# EAGLE design Adafruit MCP23017 GPIO Expander (EAGLE 9.6.2)
COMPANY: ADAFRUIT INDUSTRIES; DRAWN: KTOWN; REV: A
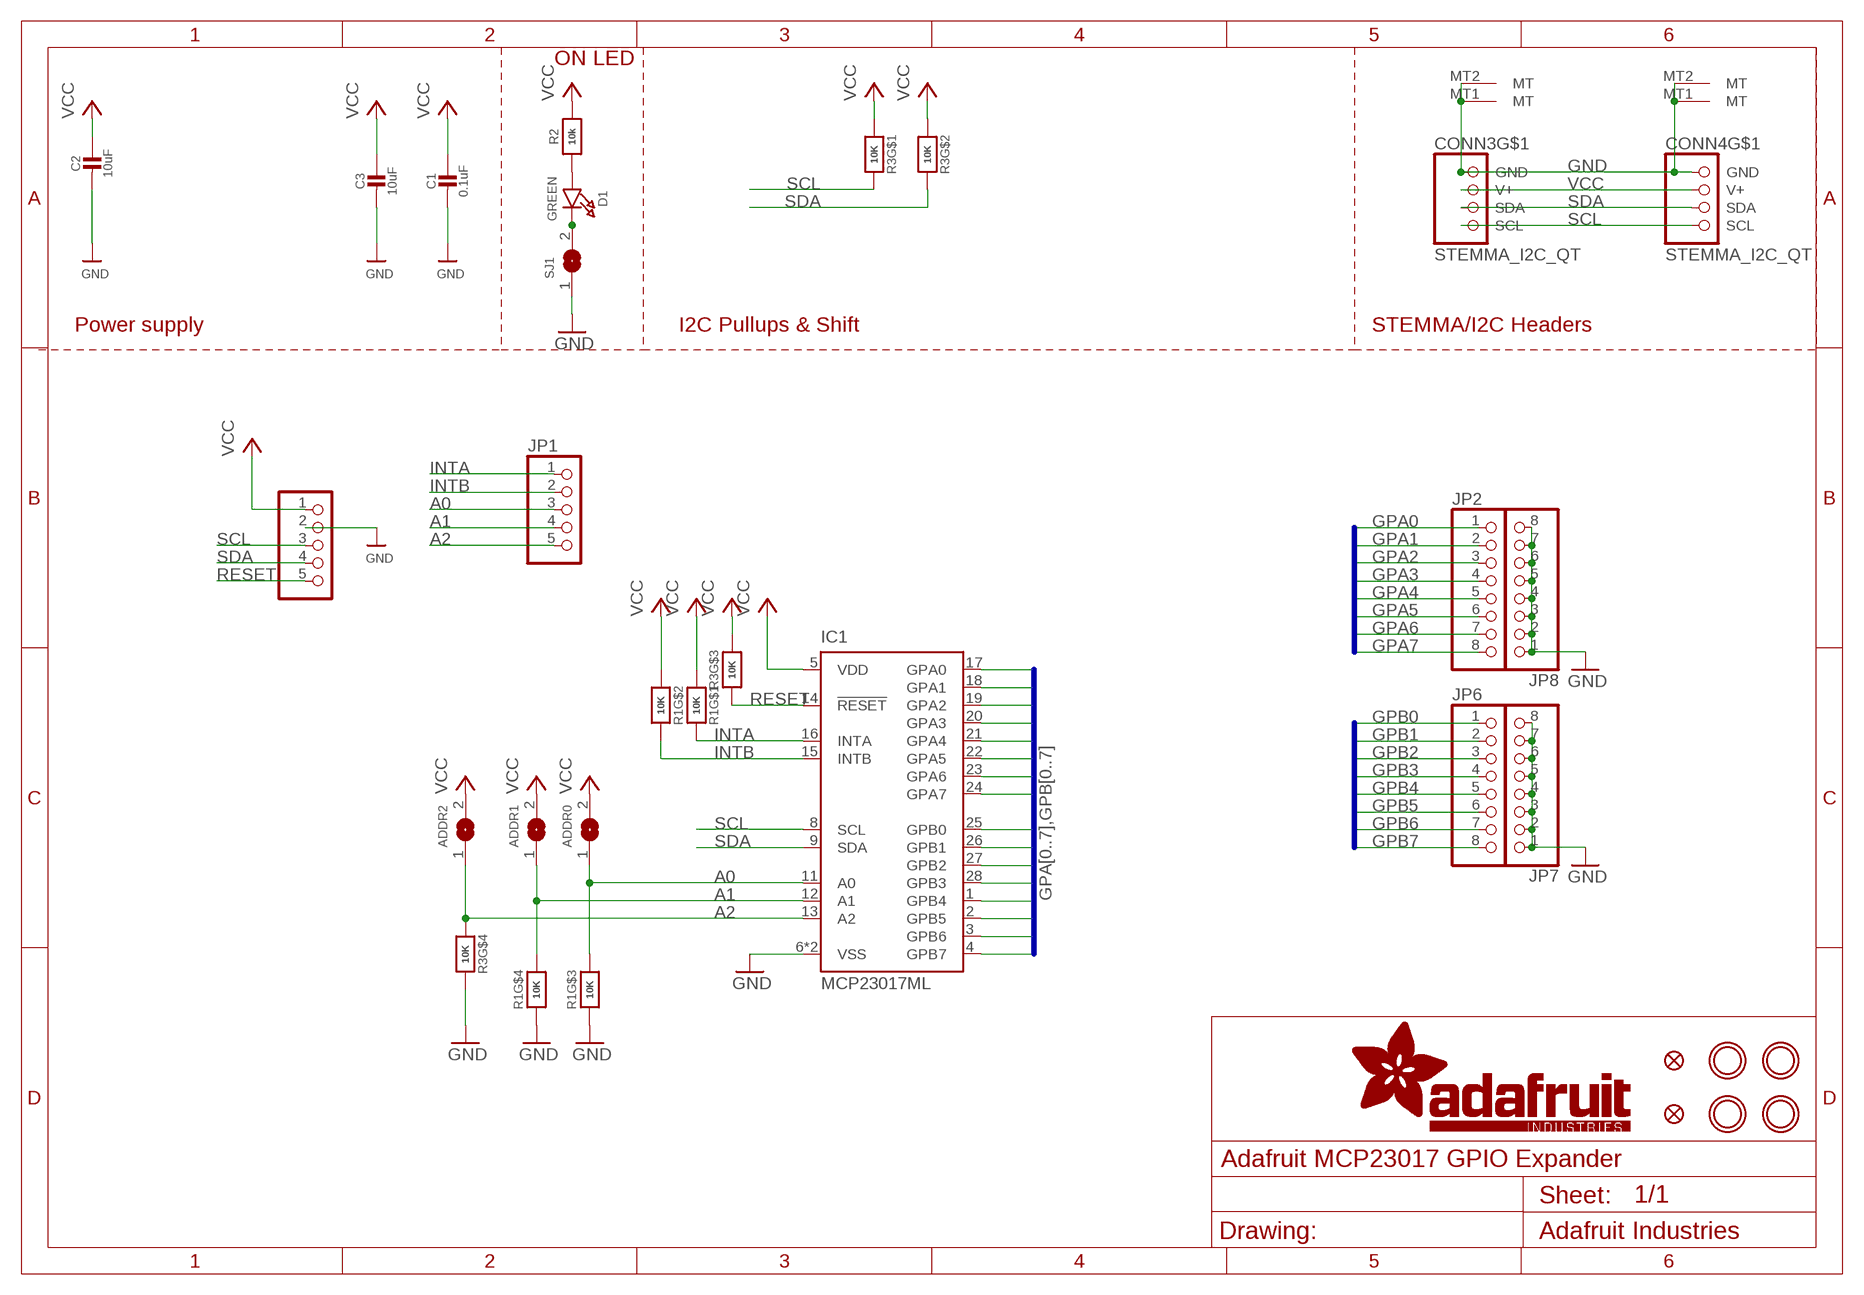
[diagram p0: schematic, sheet 1]

## Parts
ADDR0  SOLDERJUMPER  [SOLDERJUMPER_ARROW_NOPASTE]
ADDR1  SOLDERJUMPER  [SOLDERJUMPER_ARROW_NOPASTE]
ADDR2  SOLDERJUMPER  [SOLDERJUMPER_ARROW_NOPASTE]
C1  0.1uF  CAP_CERAMIC0603_NO  [0603-NO]
C2  10uF  CAP_CERAMIC0805-NOOUTLINE  [0805-NO]
C3  10uF  CAP_CERAMIC0805-NOOUTLINE  [0805-NO]
CONN3  STEMMA_I2C_QT  [JST_SH4]
CONN4  STEMMA_I2C_QT  [JST_SH4]
D1  GREEN  LED0603_NOOUTLINE  [CHIPLED_0603_NOOUTLINE]
FID3  FIDUCIAL_1MM  [FIDUCIAL_1MM]
FID4  FIDUCIAL_1MM  [FIDUCIAL_1MM]
IC1  MCP23017ML  [QFN28-ML_6X6MM]
JP1  HEADER-1X570MIL  [1X05_ROUND_70]
JP2  HEADER-1X870MIL  [1X08_ROUND_70]
JP5  HEADER-1X570MIL  [1X05_ROUND_70]
JP6  HEADER-1X870MIL  [1X08_ROUND_70]
JP7  HEADER-1X870MIL  [1X08_ROUND_70]
JP8  HEADER-1X870MIL  [1X08_ROUND_70]
R1  10K  RESISTOR_4PACK  [RESPACK_4X0603]
R2  10k  RESISTOR_0603_NOOUT  [0603-NO]
R3  10K  RESISTOR_4PACK  [RESPACK_4X0603]
SJ1  SOLDERJUMPERCLOSED  [SOLDERJUMPER_CLOSEDWIRE]
U$1  MOUNTINGHOLE2.5  [MOUNTINGHOLE_2.5_PLATED]
U$17  MOUNTINGHOLE2.5  [MOUNTINGHOLE_2.5_PLATED]
U$19  MOUNTINGHOLE2.5  [MOUNTINGHOLE_2.5_PLATED]
U$21  MOUNTINGHOLE2.5  [MOUNTINGHOLE_2.5_PLATED]

## Nets
A0: ADDR0.1 IC1.11(A0) JP1.3 R1.6
A1: ADDR1.1 IC1.12(A1) JP1.4 R1.5
A2: ADDR2.1 IC1.13(A2) JP1.5 R3.4
GND [highpower]: C1.2 C2.2 C3.2 CONN3.1(GND) CONN3.MT1(MT) CONN3.MT2(MT) CONN4.1(GND) CONN4.MT1(MT) CONN4.MT2(MT) IC1.6(VSS) IC1.EXP(VSS) JP5.2 JP7.1 JP7.2 JP7.3 JP7.4 JP7.5 JP7.6 JP7.7 JP7.8 JP8.1 JP8.2 JP8.3 JP8.4 JP8.5 JP8.6 JP8.7 JP8.8 R1.3 R1.4 R3.5 SJ1.1
GPA0: IC1.17(GPA0) JP2.1
GPA1: IC1.18(GPA1) JP2.2
GPA2: IC1.19(GPA2) JP2.3
GPA3: IC1.20(GPA3) JP2.4
GPA4: IC1.21(GPA4) JP2.5
GPA5: IC1.22(GPA5) JP2.6
GPA6: IC1.23(GPA6) JP2.7
GPA7: IC1.24(GPA7) JP2.8
GPB0: IC1.25(GPB0) JP6.1
GPB1: IC1.26(GPB1) JP6.2
GPB2: IC1.27(GPB2) JP6.3
GPB3: IC1.28(GPB3) JP6.4
GPB4: IC1.1(GPB4) JP6.5
GPB5: IC1.2(GPB5) JP6.6
GPB6: IC1.3(GPB6) JP6.7
GPB7: IC1.4(GPB7) JP6.8
INTA: IC1.16(INTA) JP1.1 R1.8
INTB: IC1.15(INTB) JP1.2 R1.7
N$1: D1.A R2.1
N$2 [highpower]: D1.C SJ1.2
RESET: IC1.14(!RESET) JP5.5 R3.3
SCL: CONN3.4(SCL) CONN4.4(SCL) IC1.8(SCL) JP5.3 R3.8
SDA: CONN3.3(SDA) CONN4.3(SDA) IC1.9(SDA) JP5.4 R3.7
VCC [highpower]: ADDR0.2 ADDR1.2 ADDR2.2 C1.1 C2.1 C3.1 CONN3.2(V+) CONN4.2(V+) IC1.5(VDD) JP5.1 R1.1 R1.2 R2.2 R3.1 R3.2 R3.6

## Buses
GPA[0..7],GPB[0..7]

## Notes on the sheet
- ON LED
- Power supply | I2C Pullups & Shift | STEMMA/I2C Headers

## Library data of the parts
ADDR0 ADDR1 ADDR2 = microbuilder:SOLDERJUMPER: SMD Solder JUMPER Solder the two pads together to create a connection, or remove the solder to break it. REFLOW - Use this footprint for solder paste and reflow ovens. WAVE - Use this footprint for hand-soldering (larger pads). CLOSED - Has a trace between the two pads to ensure it is closed by default. The trace needs to be cut to disable the jumper, and can be closed again by creating a solder bridge between the two pads.; BOM: EXCLUDE
C1-C3 = microbuilder:CAP_CERAMIC: Ceramic Capacitors For new designs, use the packages preceded by an '_' character since they are more reliable: The following footprints should be used on most boards: _0402 - Standard footprint for regular board layouts _0603 - Standard footprint for regular board layouts _0805 - Standard footprint for regular board layouts _1206 - Standard footprint for regular board layouts For extremely tight-pitch boards where space is at a premium, the following 'micro-pitch' footprints can be used (smaller pads, no silkscreen outline, etc.): _0402MP - Micro-pitch footprint for very dense/compact boards _0603MP - Micro-pitch footprint for very dense/compact boards _0805MP - Micro-pitch footprint for very dense/compact boards _1206MP - Micro-pitch footprint for very dense/compact boards
CONN3 CONN4 = microbuilder:STEMMA_I2C
D1 = microbuilder:LED: LED 0603 - 0603 Surface Mount Package 2mA: Green LED - Low Power (3.9mcd, 2ma, 1.7Vf) - Digikey: 475-2709-2-ND Orange LED - Low Power (9.8mcd, 2ma, 1.8Vf) - Digikey: 475-1194-2-ND Red LED - Low Power (5mcd, 2ma, 1.8Vf) - Digikey: 475-1195-2-ND Yellow LED - Low Power (7mcd, 2ma, 1.8Vf) - Digikey: 475-1196-2-ND 5mA: Blue LED - Low Power (17mcd, 5ma, 2.9Vf) - Digikey: LNJ937W8CRACT-ND 0805 - 0805 Surface Mount Package 2mA: Red LED (8.8mcd, 2mA, 1.8Vf, Clear) - Low Power [Digikey: 475-2510-1-ND] Green LED (5mcd, 2mA, 1.8Vf, Clear) - Low Power [Digikey: 475-2730-1-ND] Yellow LED (11.3mcd, 2mA, 1.8Vf, Clear) - Low Power [Digikey: 475-2555-1-ND] 20mA: Red LED (104mcd, 20mA, Diffused) - LS R976 [Digikey: 475-1278-6-ND] Red LED (12mcd, 20mA, 2.0Vf, Clear) - APT2012EC [Digikey: 754-1128-1-ND] Green LED (15mcd, 20mA, 2.2Vf, Clear) - APT2012GC [Digikey: 754-1131-1-ND] Orange LED (160mcd, 20mA, 2.1Vf, Clear) - APT2012SECK [Digikey: 754-1130-1-ND] 1206 - 1206 Surface Mount Package Green LED (26mcd, 20mA, Diffused) - LG N971 [Digikey: 475-1407-6-ND] Red LED (15mcd, 20mA, Diffused) - LH N974 [Digikey: 475-1416-6-ND] Cree - Cree High-Power Surface Mount LEDs XPEBWT-L1-0000-00D50 - White 111lm 350mA 2.9Vf 6200K 110° XTEAWT-00-0000-00000LEE3 - White 114lm 350mA 2.85Vf 5000K 115° Everlight - Everlight 45-21 Series Surface Mount LEDs 45-21/QK2C-B2832AC2CB2/2T - Warm White 2000mcd 20mA 3.25Vf 3050K 120° 45-21/LK2C-B38452C4CB2/2T - Nuetral White 2000mcd 20mA 3.25Vf 4150K 120° 45-21/LK2C-B50634C6CB2/2T - Cold White 2200mcd 20mA 3.25Vf 5650K 120° PLCC2 Reverse Mount LS T77K-J1L2-1-0-2-R18-Z - Red 11.25mcd 2mA 1.8Vf 630nm 120° LO T77K-L1M2-24-Z - Orange 19.6mcd 2mA 1.8Vf 606nm 120° LY T77K-K2M1-26-Z - Yellow 15.7mcd 2mA 1.8Vf 587nm 120°
FID3 FID4 = microbuilder:FIDUCIAL: Fiducial Alignment Points Various fiducial points for machine vision alignment.; BOM: EXCLUDE
IC1 = microbuilder:MCP23017: http://ww1.microchip.com/downloads/en/DeviceDoc/21952a.pdf Source: http://ww1.microchip.com/downloads/en/DeviceDoc/21952a.pdf; MF: MICROCHIP; MPN: MCP23017-E/ML; OC_FARNELL: unknown; OC_NEWARK: 31K2957
JP1 JP5 = microbuilder:HEADER-1X5: PIN HEADER
JP2 JP6-JP8 = microbuilder:HEADER-1X8: PIN HEADER
R1 R3 = microbuilder:RESISTOR_4PACK: Resistor Packs (4 resistors) 4 x 0603 10K 1/16W - Digikey: YC164J-10KCT-ND
R2 = microbuilder:RESISTOR: Resistors For new designs, use the packages preceded by an '_' character since they are more reliable: The following footprints should be used on most boards: _0402 - Standard footprint for regular board layouts _0603 - Standard footprint for regular board layouts _0805 - Standard footprint for regular board layouts _1206 - Standard footprint for regular board layouts For extremely tight-pitch boards where space is at a premium, the following 'micro-pitch' footprints can be used (smaller pads, no silkscreen outline, etc.): _0402MP - Micro-pitch footprint for very dense/compact boards _0603MP - Micro-pitch footprint for very dense/compact boards _0805MP - Micro-pitch footprint for very dense/compact boards _1206MP - Micro-pitch footprint for very dense/compact boards
SJ1 = microbuilder:SOLDERJUMPER: SMD Solder JUMPER Solder the two pads together to create a connection, or remove the solder to break it. REFLOW - Use this footprint for solder paste and reflow ovens. WAVE - Use this footprint for hand-soldering (larger pads). CLOSED - Has a trace between the two pads to ensure it is closed by default. The trace needs to be cut to disable the jumper, and can be closed again by creating a solder bridge between the two pads.
U$1 U$17 U$19 U$21 = adafruit_electromech:MOUNTINGHOLE: Mounting Hole For #2 screws (0.086"/2.18mm width, 0.094"/2.4mm hole) use 2.5mm; BOM: EXCLUDE

## Net classes
1 highpower: width 0.305 mm, drill 0.483 mm
2 lowpower: width 0.254 mm, drill 0.483 mm

## Board
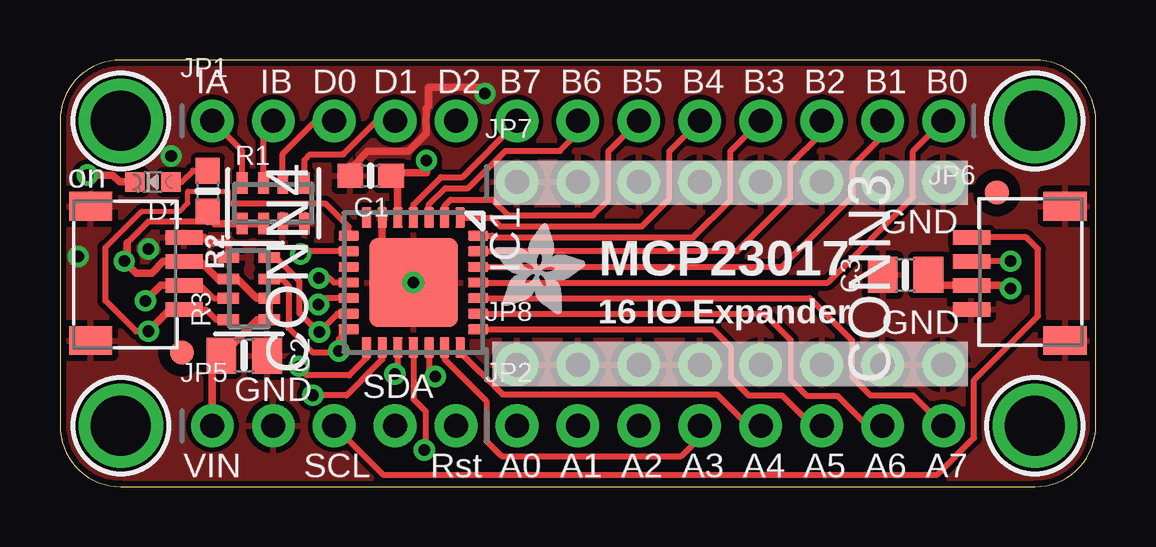
[diagram p1: board, top side]
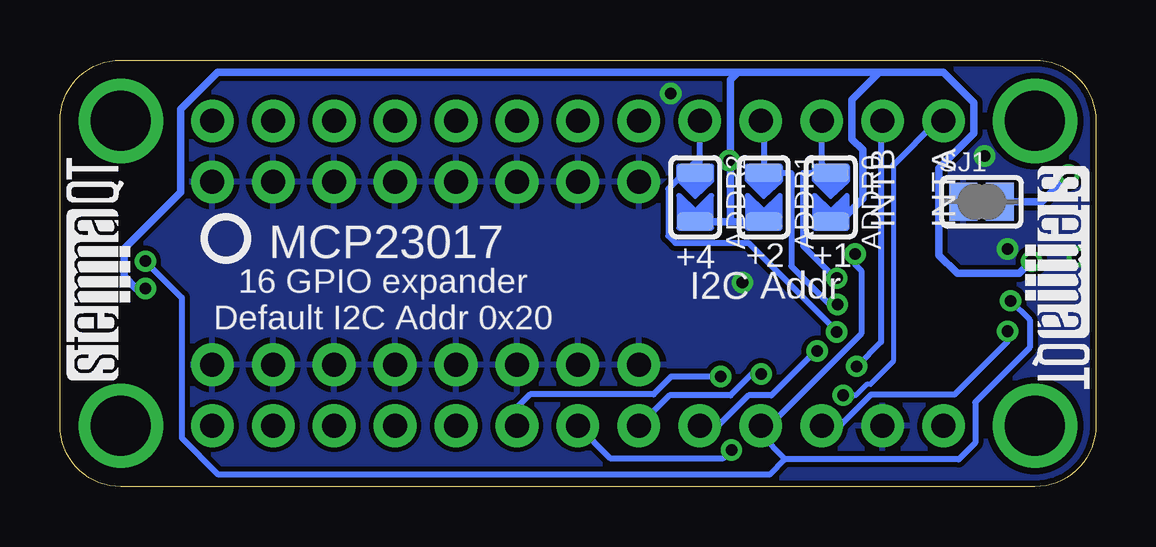
[diagram p2: board, bottom side, seen from below]

Size 43.18 x 17.78 mm. Coordinates in mm from the lower left corner, seen from the top.
Outline: 0,15.24 0,2.54 arc90 2.54,0 40.64,0 arc90 43.18,2.54 43.18,15.24 arc90 40.64,17.78 2.54,17.78 arc90 0,15.24
Copper layers (1*16): Top 0.035mm / dielectric 1.5mm / Bottom 0.035mm
Design rules "adafruit *": minimum track width 8mil, minimum drill 15.5mil, track to track 8mil, track to pad 8mil, pad to pad 8mil, via to via 8mil, smd to smd 8mil, copper to edge 10mil, drill to drill 8mil, minimum pad ring 10mil, minimum via ring 8mil, stop-mask expansion 2mil, vias tented up to drill 20mil, thermal gap 10mil

### Footprints (pad centres in the part's own frame; a part is rotated, then mirrored left to right if it is on the bottom)
SOLDERJUMPER_ARROW_NOPASTE = smd 0.762 x 1.524: 1 -1.016,0; 2 1.016,0
0603-NO = smd 1.075 x 1: 1 -0.85,0; 2 0.85,0
0805-NO = smd 1.24 x 1.5: 1 -0.95,0; 2 0.95,0
JST_SH4 = smd 0.6 x 1.55: 1 -1.5,2.514; 2 -0.5,2.514; 3 0.5,2.514; 4 1.5,2.514 | smd 1.2 x 1.8: MT1 -2.8,-1.386; MT2 2.8,-1.386
CHIPLED_0603_NOOUTLINE = smd 0.8 x 0.8: A 0,-0.75; C 0,0.75
FIDUCIAL_1MM = smd 1 x 1: 1 0,0
QFN28-ML_6X6MM = smd 0.85 x 0.4: 1 -2.7,1.95; 2 -2.7,1.3; 3 -2.7,0.65; 4 -2.7,0; 5 -2.7,-0.65; 6 -2.7,-1.3; 7 -2.7,-1.95; 15 2.7,-1.95; 16 2.7,-1.3; 17 2.7,-0.65; 18 2.7,0; 19 2.7,0.65; 20 2.7,1.3; 21 2.7,1.95 | smd 0.4 x 0.85: 8 -1.95,-2.7; 9 -1.3,-2.7; 10 -0.65,-2.7; 11 0,-2.7; 12 0.65,-2.7; 13 1.3,-2.7; 14 1.95,-2.7; 22 1.95,2.7; 23 1.3,2.7; 24 0.65,2.7; 25 0,2.7; 26 -0.65,2.7; 27 -1.3,2.7; 28 -1.95,2.7 | smd 3.7 x 3.7: EXP 0,0
1X05_ROUND_70 = drill 1 pad 1.778: 1 -5.08,0; 2 -2.54,0; 3 0,0; 4 2.54,0; 5 5.08,0
1X08_ROUND_70 = drill 1 pad 1.778: 1 -8.89,0; 2 -6.35,0; 3 -3.81,0; 4 -1.27,0; 5 1.27,0; 6 3.81,0; 7 6.35,0; 8 8.89,0
RESPACK_4X0603 = smd 0.45 x 0.9: 1 -1.3,-0.85; 2 -0.4,-0.85; 3 0.4,-0.85; 4 1.3,-0.85; 5 1.3,0.85; 6 0.4,0.85; 7 -0.4,0.85; 8 -1.3,0.85
SOLDERJUMPER_CLOSEDWIRE = smd 1.168 x 1.6: 1 -0.762,0; 2 0.762,0 | smd 0.635 x 0.203: WIRE 0,0
MOUNTINGHOLE_2.5_PLATED = drill 2.5 pad 3.2: P$1 0,0

### Placement (x,y rotation side)
ADDR0  11.05,12.06 270 bottom
ADDR1  13.84,12.06 270 bottom
ADDR2  16.7,12.06 270 bottom
C1  12.95,12.95 180 top
C2  7.68,5.46 0 top
C3  35.24,8.83 180 top
CONN3  40.51,8.89 90 top
CONN4  2.67,8.89 270 top
D1  3.87,12.7 90 top
FID3  5.08,5.59 0 top
FID4  39.05,12.26 0 top
IC1  14.73,8.51 270 top
JP1  11.43,15.24 0 top
JP2  27.94,2.54 0 top
JP5  11.43,2.54 0 top
JP6  27.94,15.24 180 top
JP7  27.94,12.7 0 top
JP8  27.94,5.08 0 top
R1  8.89,11.81 0 top
R2  6.16,12.32 270 top
R3  7.87,8.26 90 top
SJ1  4.76,11.87 0 bottom
U$1  2.54,15.24 0 top
U$17  40.64,15.24 0 top
U$19  2.54,2.54 0 top
U$21  40.64,2.54 0 top
U$22  [ADAFRUIT_3.5MM]  18.1,7.18 0 top
U$25  [PCBFEAT-REV-040]  36.26,10.35 0 bottom
U$30  [STEMMAQT]  40.26,4.45 90 bottom
U$31  [STEMMAQT]  2.92,13.34 270 bottom

### Tracks (layer width: path | path; a pad name or v marks a point on that pad's centre or on a via)
A0  (via drill 0.48)
  Top 0.254: R1.6 9.29,13.88 10.65,15.24 JP1.3 | IC1.11 11.42,8.51 11.24,8.69 v10.79,8.69
  Bottom 0.254: JP1.3 11.43,13.46 ADDR0.1 12.19,13.08 12.19,10.02 10.86,8.69 v10.79,8.69
A1  (via drill 0.48)
  Top 0.254: R1.5 10.19,13.62 10.41,13.84 11.81,13.84 13.21,15.24 JP1.4 | IC1.12 11.03,7.86 v10.77,7.6
  Bottom 0.254: JP1.4 13.84,15.11 ADDR1.1 12.7,13.08 12.7,9.19 11.11,7.6 v10.77,7.6
A2  (via drill 0.48)
  Top 0.254: IC1.13 11.57,7.21 v10.81,6.45 10.49,6.76 10.45,6.76 9.98,7.23 9.98,8.57 9,9.55 R3.4
  Bottom 0.254: ADDR2.1 16.7,13.53 16.76,13.46 | JP1.5 16.51,13.46 16.76,13.46 | 16.76,13.46 17.82,12.41 17.82,10.45 17.53,10.16 14.48,10.16 10.81,6.49 v10.81,6.45
GND  (via drill 0.48)
  Top 0.305: CONN4.1 5.99,10.39 6.23,10.15 6.99,10.15 7.02,10.12 R3.5 | IC1.6 13.43,9.81 IC1.EXP | 1.28,11.81 CONN4.MT1 | C1.2 12.1,13.36 12.29,13.36 12.29,13.44 12.83,13.97 14.53,13.97 15.27,14.71 15.27,15.76 15.37,15.86 15.37,16.64 17.46,16.64 v17.72,16.38
  other vias: 4.64,13.78 3.68,9.91 14.73,8.51 0.76,9.59
  pour Top: 0,17.78 43.18,17.78 43.18,0 0,0
  pour Bottom: 0,17.78 43.18,17.78 43.18,0 0,0
GPA0  (via drill 0.48)
  Top 0.254: IC1.17 14.08,4.82 v13.96,4.7
  Bottom 0.254: v13.96,4.7 14.34,4.7 15.23,3.81 17.78,3.81 JP2.1
GPA1  (via drill 0.48)
  Top 0.254: IC1.18 14.73,3.65 15.24,3.14 15.24,1.58 v15.19,1.52
  Bottom 0.254: v15.19,1.52 15.52,1.2 20.25,1.2 JP2.2
GPA2  (via drill 0.48)
  Top 0.254: IC1.19 15.38,4.86 v15.64,4.6
  Bottom 0.254: v15.64,4.6 17.69,4.6 18.44,3.85 23.58,3.85 24.13,3.3 JP2.3
GPA3
  Top 0.254: IC1.20 16.03,5.3 17.78,3.56 17.78,1.9 18.41,1.27 25.91,1.27 26.67,2.03 JP2.4
GPA4
  Top 0.254: IC1.21 16.68,5.61 18.44,3.85 27.39,3.85 28.7,2.54 JP2.5
GPA5
  Top 0.254: IC1.22 27.22,6.56 27.96,5.82 27.96,4.55 28.7,3.81 30.1,3.81 31.37,2.54 JP2.6
GPA6
  Top 0.254: JP2.7 33.66,2.54 32.41,3.79 31.14,3.79 30.45,4.47 30.45,6.12 29.37,7.21 IC1.23
GPA7
  Top 0.254: JP2.8 35.56,3.81 33.78,3.81 33.02,4.57 33.02,6.1 31.26,7.86 IC1.24
GPB0
  Top 0.254: IC1.25 32,8.51 35.56,12.06 35.56,13.97 JP6.1
GPB1
  Top 0.254: JP6.2 34.29,14.61 33.06,13.37 33.06,12.12 30.1,9.16 IC1.26
GPB2
  Top 0.254: IC1.27 18.19,9.81 18.19,9.8 28.22,9.8 30.45,12.04 30.45,13.44 31.75,14.73 JP6.3
GPB3
  Top 0.254: IC1.28 18.02,10.46 18.09,10.39 26.39,10.39 27.94,11.94 27.94,13.97 JP6.4
GPB4
  Top 0.254: IC1.1 17.98,11.21 18.35,10.85 24.26,10.85 25.4,11.99 25.4,13.97 JP6.5
GPB5
  Top 0.254: IC1.2 16.03,11.71 16.28,11.96 18.01,11.96 18.67,11.3 22.23,11.3 22.86,11.94 22.86,13.97 JP6.6
GPB6
  Top 0.254: IC1.3 15.38,11.76 16.07,12.45 17.02,12.45 18.57,13.99 20.85,13.99 21.59,14.73 JP6.7
GPB7
  Top 0.254: IC1.4 14.73,11.76 15.88,12.9 16.78,12.9 19.05,15.18 JP6.8
INTA  (via drill 0.48)
  Top 0.254: R1.8 7.59,14 JP1.1 | v10.54,3.81 11.94,3.81 13.43,5.3 IC1.16
  Bottom 0.203: 8.45,13.4 8.45,5.22 9.4,4.27 9.55,4.27 10.01,3.81 10.1,3.81
  Bottom 0.254: 10.1,3.81 v10.54,3.81 | 8.45,13.4 6.6,15.24 JP1.1
INTB  (via drill 0.48)
  Top 0.254: R1.7 8.49,14.84 JP1.2 | IC1.15 12.78,5.36 12.05,4.64 10.29,4.64 9.97,4.95 v9.97,5.02
  Bottom 0.254: v9.97,5.02 8.95,6.03 8.95,15.18 JP1.2
N$1
  Top 0.254: R2.1 5.55,13.17 5.08,12.7 D1.A
N$2  (via drill 0.48)
  Top 0.305: D1.C 2.49,12.7 2.2,12.99 v1.14,12.99
  Bottom 0.305: SJ1.2 2.25,11.87 v1.14,12.99
RESET  (via drill 0.48)
  Top 0.254: R3.3 9.25,8.65 9.53,8.38 9.53,6.6 10.54,5.59 11.56,5.59 v11.62,5.65 11.62,6.15 IC1.14
  Bottom 0.254: v11.62,5.65 11.68,5.65 13.53,3.81 14.48,3.81 15.75,2.54 JP5.5
SCL  (via drill 0.48)
  Top 0.203: 7.11,11.81 7.03,11.81 7.03,12.32 5.33,12.32 5.33,11.8 5,11.48 3.42,11.48 1.91,9.97
  Top 0.254: CONN4.4 6.08,7.39 6.52,6.96 R3.8 | JP5.3 13.46,0.51 36.58,0.51 38.1,2.03 38.1,4.45 40.77,7.11 40.77,9.91 40.28,10.39 CONN3.4 | IC1.8 12.03,10.83 11.05,11.81 7.11,11.81 | v3.68,6.48 3.17,6.48 1.91,7.75 1.91,9.97
  Top 0.305: CONN4.4 4.6,7.39 v3.68,6.48
  Bottom 0.254: JP5.3 10.67,2.54 9.37,3.83 5.9,3.83 3.68,6.05 v3.68,6.48
SDA  (via drill 0.48)
  Top 0.254: CONN4.3 5.85,8.39 6.39,7.86 R3.7 | v39.62,9.4 v39.62,9.39 CONN3.3 | IC1.9 10.14,9.81 v10.03,9.7
  Top 0.305: CONN4.3 4.2,8.39 v3.56,7.75
  Bottom 0.254: v3.56,7.75 2.76,6.95 2.76,5.79 5.03,3.52 5.03,1.83 5.71,1.14 12.95,1.14 | 12.95,1.14 13.97,2.16 JP5.4 13.62,2.54 9.78,6.38 9.78,9 10.03,9.26 v10.03,9.7 | 12.95,1.14 13.59,0.51 36.58,0.51 38.1,2.03 38.1,7.87 v39.62,9.4
VCC  (via drill 0.48)
  Top 0.254: 6.16,11.05 3.68,11.05 2.79,10.16
  Top 0.305: JP5.1 6.35,5.08 C2.1 8.23,6.96 R3.1 R3.2 8.2,7.86 7.4,8.65 R3.6 6.58,8.65 5.85,9.39 CONN4.2 4.31,9.39 3.82,8.9 3.17,8.9 v2.68,9.4 2.79,9.51 2.79,10.16 | IC1.5 14.08,12.68 C1.1 13.93,13.08 15.28,13.08 v15.28,13.59 | R1.2 R1.1 6.45,10.96 6.23,11.18 6.16,11.18 | C3.1 36.63,8.39 CONN3.2 39.49,8.39 v39.62,8.26 | R2.2 6.16,11.18 | 6.16,11.18 6.16,11.05
  Bottom 0.305: v2.68,9.4 3.19,8.89 5.78,8.89 6.54,9.65 6.54,13.27 5.08,14.73 5.08,16 6.35,17.27 9.02,17.27 | ADDR0.2 10.67,11.05 9.72,12 9.72,14.03 10.16,14.48 10.16,16.13 9.02,17.27 | ADDR2.2 15.24,11.05 | 15.24,11.05 ADDR1.2 | 15.24,11.05 15.24,13.55 v15.28,13.59 15.24,13.63 15.24,16.95 14.92,17.27 | 14.92,17.27 9.02,17.27 | v39.62,8.26 40.01,8.26 40.51,8.76 40.51,9.91 38.15,12.27 38.15,15.73 36.61,17.27 14.92,17.27

### Text on the board
tPlace: IA | IB | D0 | D1 | D2 | B7 | B6 | B5 | B4 | B3 | B2 | B1 | B0 | on | GND | MCP23017 | 16 IO Expander | GND | GND | SDA | VIN | SCL | Rst | A0 | A1 | A2 | A3 | A4 | A5 | A6 | A7
bPlace: INTA | INTB | +1 | +2 | +4 | MCP23017 | I2C Addr | 16 GPIO expander / Default I2C Addr 0x20